# EAGLE design preamp (EAGLE 9.0.1)

## Sheet 1 of 2
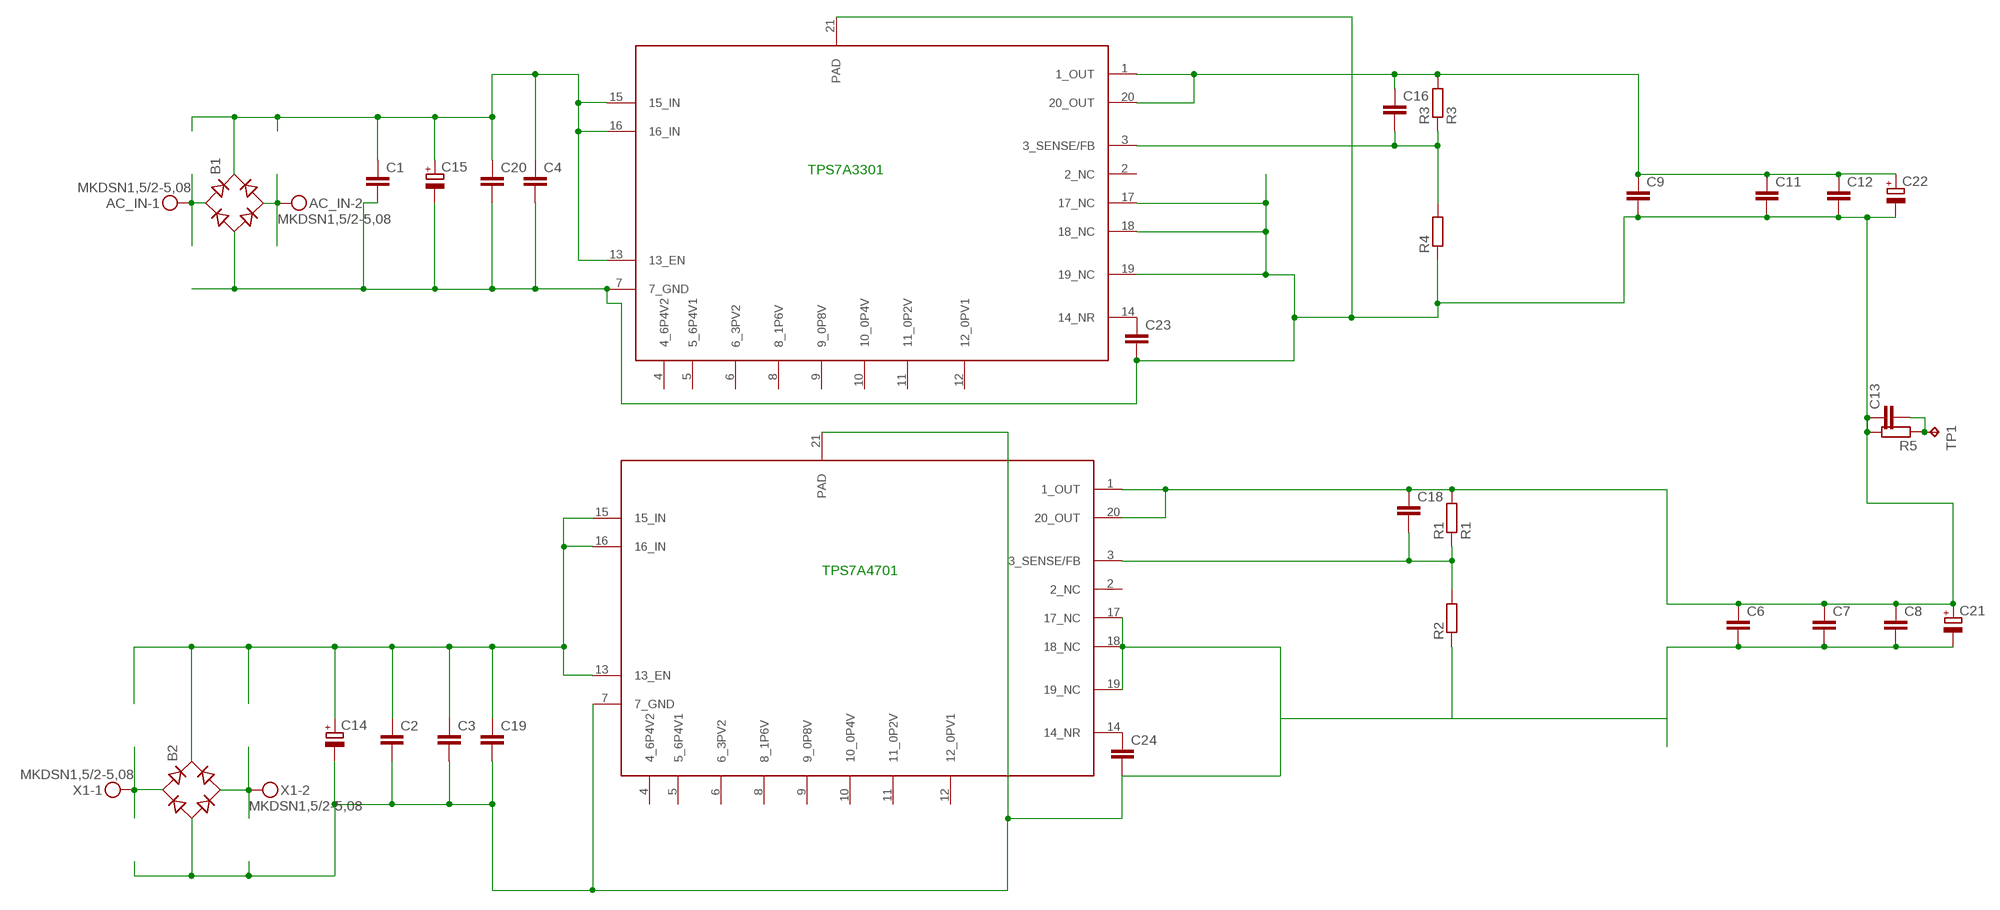
[diagram p0: schematic, sheet 1]

### Parts
AC_IN  MKDSN1,5/2-5,08  [MKDSN1,5/2-5,08]
B1  RB1A  [RB1A]
B2  RB1A  [RB1A]
C1  C-EUC1210  [C1210]
C2  C-EUC1210  [C1210]
C3  C-EUC0805  [C0805]
C4  C-EUC0805  [C0805]
C6  C-EUC0603  [C0603]
C7  C-EUC0805  [C0805]
C8  C-EUC1210  [C1210]
C9  C-EUC0603  [C0603]
C11  C-EUC1210  [C1210]
C12  C-EUC0805  [C0805]
C13  C-EU075-042X103  [C075-042X103]
C14  CPOL-EUE5-13  [E5-13]
C15  CPOL-EUE5-13  [E5-13]
C16  C-EUC0603  [C0603]
C18  C-EUC0603  [C0603]
C19  C-EUC0603  [C0603]
C20  C-EUC0603  [C0603]
C21  CPOL-EUE3.5-8  [E3,5-8]
C22  CPOL-EUE3.5-8  [E3,5-8]
C23  C-EUC0603  [C0603]
C24  C-EUC0603  [C0603]
R1  R1  R-EU_R0805  [R0805]
R2  R-EU_R0805  [R0805]
R3  R3  R-EU_R0805  [R0805]
R4  R-EU_R0805  [R0805]
R5  R-EU_0207/12  [0207/12]
TP1  TPPAD1-13  [P1-13]
U$1  TPS7A4701  [QFN65P500X500X100-21N]
U$2  TPS7A4701  [QFN65P500X500X100-21N]
X1  MKDSN1,5/2-5,08  [MKDSN1,5/2-5,08]

### Nets
GND: B1.- C1.2 C4.2 C6.1 C7.1 C8.1 C9.2 C11.2 C12.2 C13.1 C15.- C18.1 C20.2 C21.+ C22.- C23.2 R1.2 R4.1 R5.2 U$1.1(1_OUT) U$1.20(20_OUT) U$2.7(7_GND) U$2.17(17_NC) U$2.18(18_NC) U$2.19(19_NC) U$2.21(PAD) ; also sheet 2
N$2: AC_IN.1 B1.AC1
N$3: B2.+ C2.1 C3.1 C14.+ C19.1 U$1.13(13_EN) U$1.15(15_IN) U$1.16(16_IN)
N$5: C23.1 U$2.14(14_NR)
N$6: C16.2 R3.1 R4.2 U$2.3(3_SENSE/FB)
N$7: C24.1 U$1.14(14_NR)
N$9: B2.AC2 X1.2
N$10: B2.AC1 X1.1
N$12: AC_IN.2 B1.AC2
N$13: C13.2 R5.1 TP1.TP
N$15: B1.+ C1.1 C4.1 C15.+ C20.1 U$2.13(13_EN) U$2.15(15_IN) U$2.16(16_IN)
N$16: C18.2 R1.1 R2.2 U$1.3(3_SENSE/FB)
V+: C9.1 C11.1 C12.1 C16.1 C22.+ R3.2 U$2.1(1_OUT) U$2.20(20_OUT) ; also sheet 2
V-: B2.- C2.2 C3.2 C6.2 C7.2 C8.2 C14.- C19.2 C21.- C24.2 R2.1 U$1.7(7_GND) U$1.17(17_NC) U$1.18(18_NC) U$1.19(19_NC) U$1.21(PAD) ; also sheet 2
Unconnected: U$1.2(2_NC) U$1.4(4_6P4V2) U$1.5(5_6P4V1) U$1.6(6_3PV2) U$1.8(8_1P6V) U$1.9(9_0P8V) U$1.10(10_0P4V) U$1.11(11_0P2V) U$1.12(12_0PV1) U$2.2(2_NC) U$2.4(4_6P4V2) U$2.5(5_6P4V1) U$2.6(6_3PV2) U$2.8(8_1P6V) U$2.9(9_0P8V) U$2.10(10_0P4V) U$2.11(11_0P2V) U$2.12(12_0PV1)

### Notes on the sheet
- TPS7A3301
- TPS7A4701

## Sheet 2 of 2
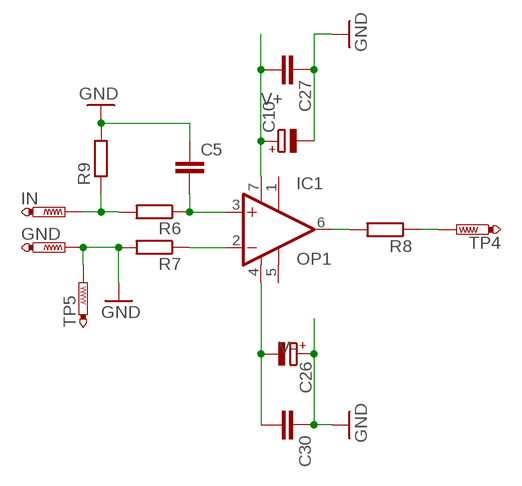
[diagram p1: schematic, sheet 2]

### Parts
C5  C-EU050-045X075  [C050-045X075]
C10  CPOL-EUE5-8.5  [E5-8,5]
C26  CPOL-EUE5-8.5  [E5-8,5]
C27  C-EU050-030X075  [C050-030X075]
C30  C-EU050-030X075  [C050-030X075]
GND  PTR1PAD1-20  [P1-20]
IC1  OP1  OPA627P  [DIL08]
IN  PTR1PAD1-20  [P1-20]
R6  R-EU_0207/10  [0207/10]
R7  R-EU_0207/10  [0207/10]
R8  R-EU_0207/10  [0207/10]
R9  R-EU_0207/10  [0207/10]
TP4  PTR1PAD1-20  [P1-20]
TP5  PTR1PAD1-20  [P1-20]

### Nets
GND: C5.1 C10.- C26.+ C27.1 C30.1 GND.TP R7.2 R9.2 TP5.TP ; also sheet 1
N$17: C5.2 IC1.3(+IN) R6.1
N$19: IC1.2(-IN) R7.1
N$20: IN.TP R6.2 R9.1
N$21: IC1.6(OUT) R8.2
N$23: R8.1 TP4.TP
V+: C10.+ C27.2 IC1.7(V+) ; also sheet 1
V-: C26.- C30.2 IC1.4(V-) ; also sheet 1
Unconnected: IC1.1(TRIM1) IC1.5(TRIM2)

## Library data of the parts
AC_IN X1 = con-phoenix-508:MKDSN1,5/2-5,08: MKDSN 1,5/ 2-5,08 Printklemme Nennstrom: 13,5 A Nennspannung: 250 V Rastermaß: 5,08 mm Polzahl: 2 Anschlussart: Schraubanschluss Montage: Löten Anschlussrichtung Leiter/Platine: 0 ° Artikelnummer: 1729128 Source: http://eshop.phoenixcontact.com .. 1729128.pdf
B1 B2 = rectifier:RB1A: RECTIFIER 1 A
C1-C9 C11-C13 C16 C18-C20 C23 C24 C27 C30 = Vwvwbg:C-EU: CAPACITOR, European symbol
C10 C14 C15 C21 C22 C26 = Vwvwbg:CPOL-EU: POLARIZED CAPACITOR, European symbol
GND IN TP4 TP5 = testpad:PTR1: TEST PIN
IC1 = burr-brown:OPA627: Difet(R) Operational Amplifiers Precision, High-Speed; MF: TEXAS INSTRUMENTS; MPN: OPA627BP; OC_FARNELL: 1212318; OC_NEWARK: 35C1918
R1-R9 = Vwvwbg:R-EU_: RESISTOR, European symbol
TP1 = testpad:TP: Test pad
U$1 U$2 = Texas Instruments_By_element14_Batch_1:TPS7A4701

## Board
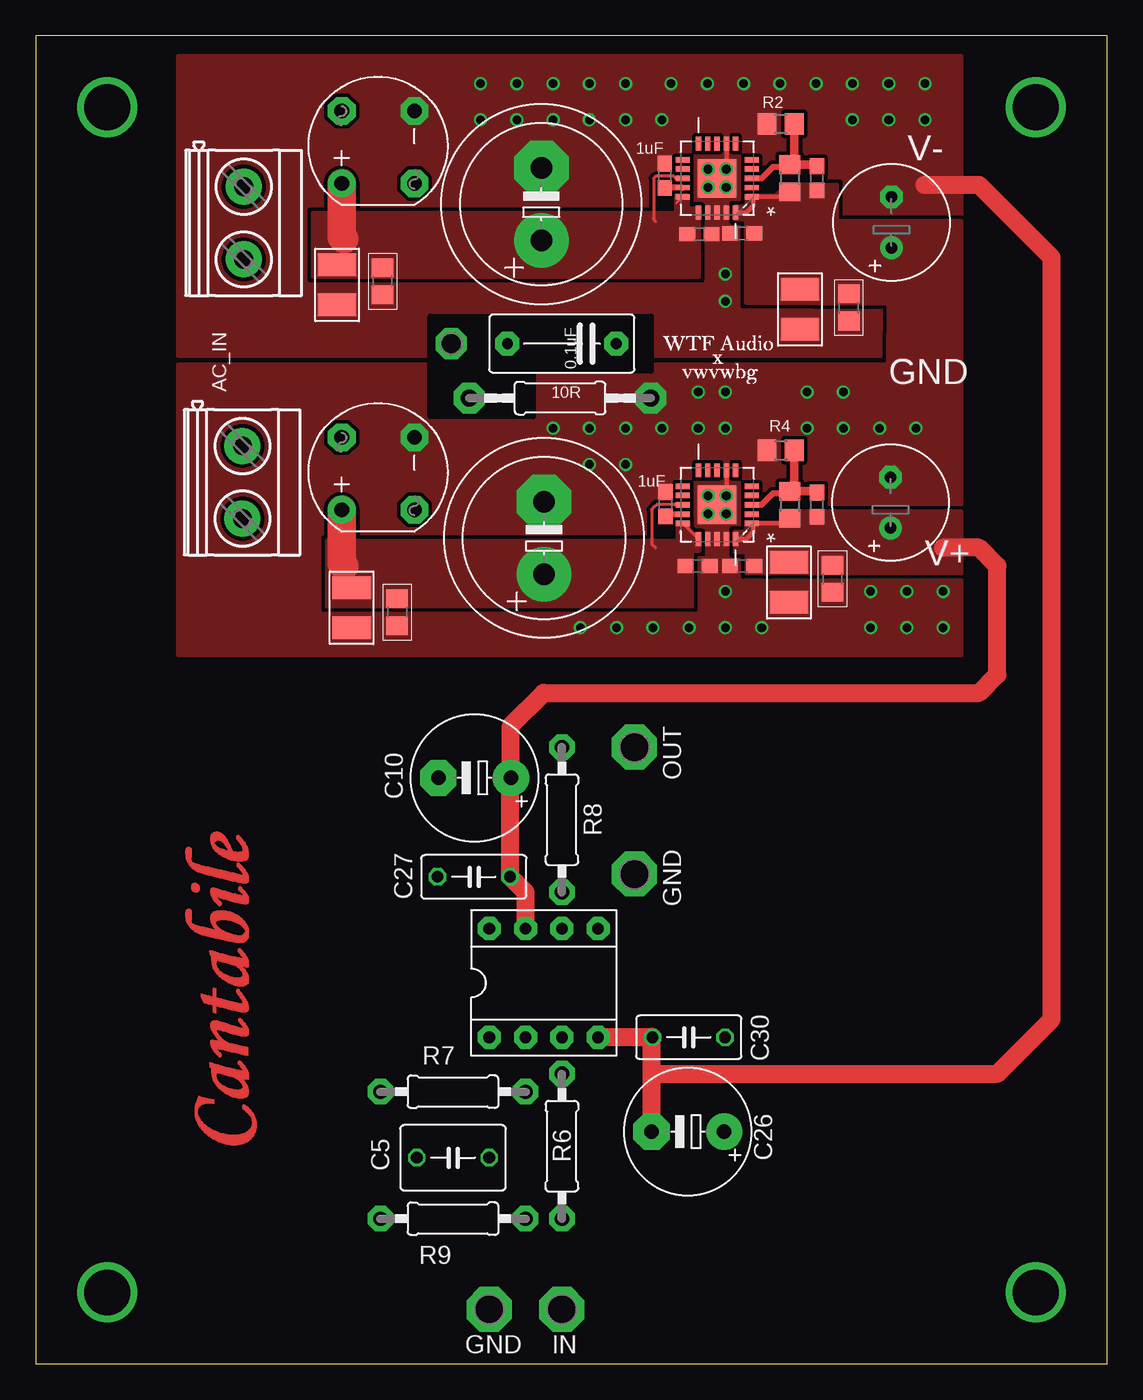
[diagram p2: board, top side]
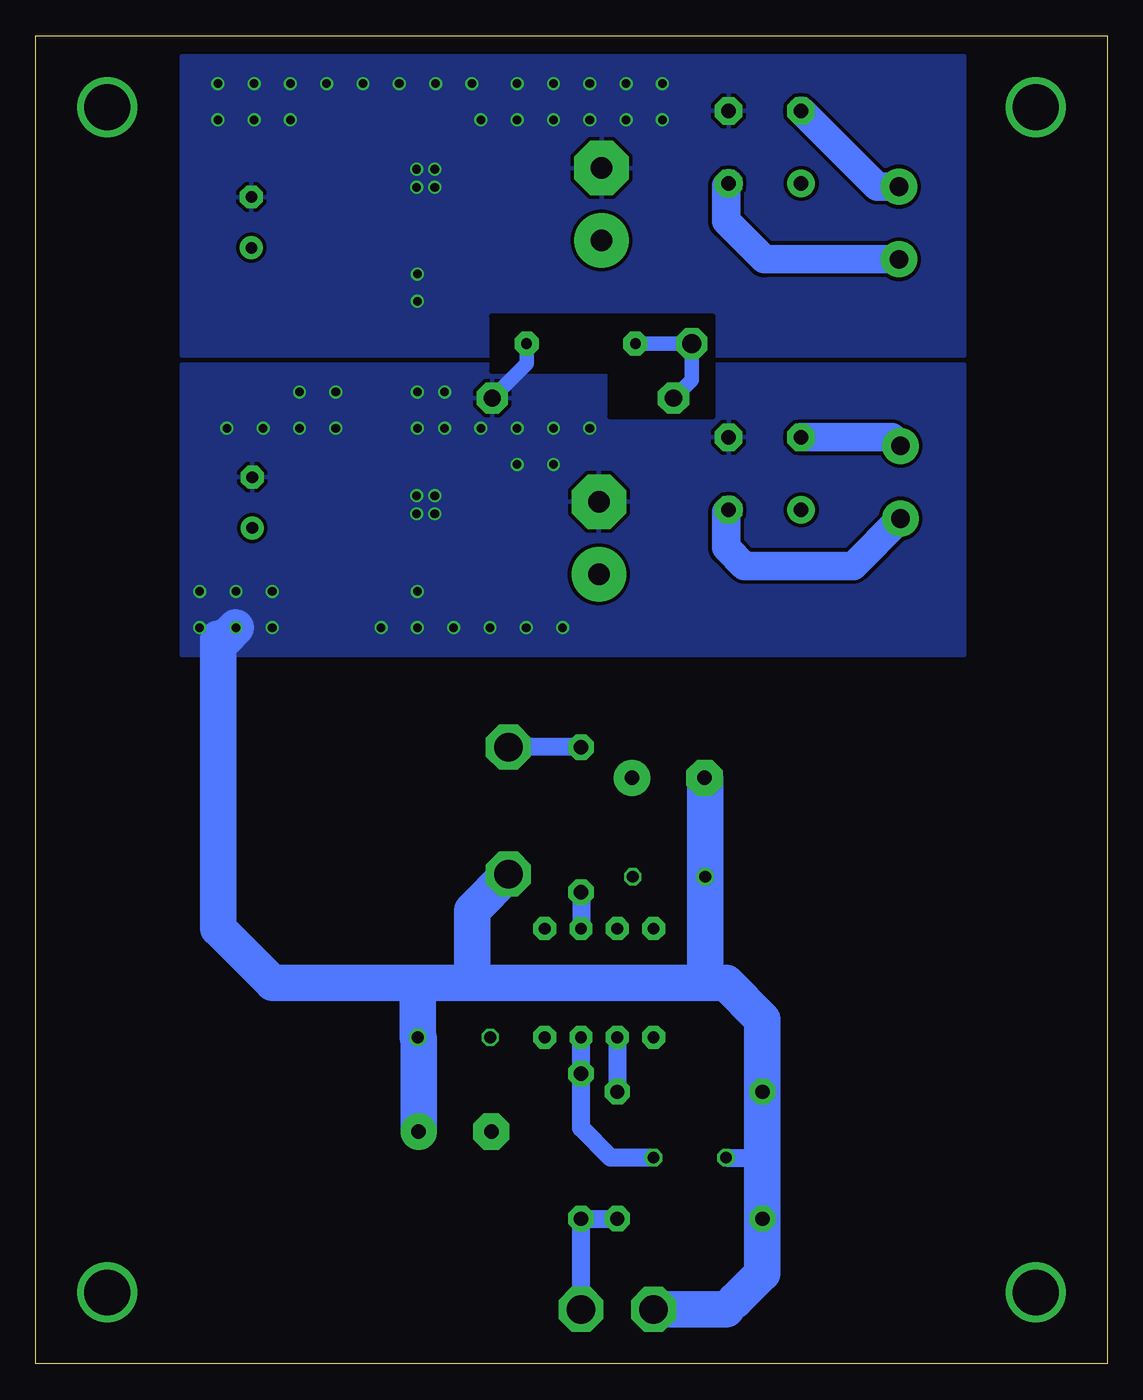
[diagram p3: board, bottom side, seen from below]

Size 75 x 93 mm. Coordinates in mm from the lower left corner, seen from the top.
Outline: 75,93 0,93 0,0 75,0 75,93
Copper layers (1*16): Top 0.035mm / dielectric 1.5mm / Bottom 0.035mm
Design rules "default *": minimum track width 6mil, minimum drill 0.3mm, track to track 7mil, track to pad 7mil, pad to pad 7mil, via to via 7mil, smd to smd 7mil, copper to edge 8mil, drill to drill 8mil, minimum pad ring 6mil, minimum via ring 6mil, stop-mask expansion 4mil, vias tented up to drill 25mil, thermal gap 10mil

### Footprints (pad centres in the part's own frame; a part is rotated, then mirrored left to right if it is on the bottom)
MKDSN1,5/2-5,08 = drill 1.3 pad 2.54: 1 -2.561,0.025; 2 2.519,0.025
RB1A = drill 1.016 pad 1.93: + -2.54,2.54 | drill 1.016 pad 1.93 octagon: - 2.54,-2.54; AC1 2.54,2.54; AC2 -2.54,-2.54
C1210 = smd 1.6 x 2.7: 1 -1.4,0; 2 1.4,0
C0805 = smd 1.3 x 1.5: 1 -0.95,0; 2 0.95,0
C050-045X075 = drill 0.813 octagon: 1 -2.54,0; 2 2.54,0
C0603 = smd 1.1 x 1: 1 -0.85,0; 2 0.85,0
E5-8,5 = drill 1.016 pad 2.54: + -2.54,0 | drill 1.016 pad 2.54 octagon: - 2.54,0
C075-042X103 = drill 0.75 pad 1.676 octagon: 1 -3.81,0; 2 3.81,0
E5-13 = drill 1.5 pad 3.81: + -2.54,0 | drill 1.5 pad 3.81 octagon: - 2.54,0
E3,5-8 = drill 0.813 pad 1.6: + -1.778,0 | drill 0.813 pad 1.6 octagon: - 1.778,0
C050-030X075 = drill 0.813 octagon: 1 -2.54,0; 2 2.54,0
P1-20 = drill 2.007 pad 3.15 octagon: TP 0,0
DIL08 = drill 0.813 pad 1.6 octagon: 1 -3.81,-3.81; 2 -1.27,-3.81; 3 1.27,-3.81; 4 3.81,-3.81; 5 3.81,3.81; 6 1.27,3.81; 7 -1.27,3.81; 8 -3.81,3.81
R0805 = smd 1.3 x 1.5: 1 -0.95,0; 2 0.95,0
0207/12 = drill 1.2 pad 2.184 octagon: 1 -6.35,0; 2 6.35,0
0207/10 = drill 1 pad 1.778 octagon: 1 -5.08,0; 2 5.08,0
P1-13 = drill 1.321 pad 2.159 octagon: TP 0,0
QFN65P500X500X100-21N = smd 0.965 x 0.381: 1 -2.413,1.295; 2 -2.413,0.66; 3 -2.413,0; 4 -2.413,-0.66; 5 -2.413,-1.295; 11 2.413,-1.295; 12 2.413,-0.66; 13 2.413,0; 14 2.413,0.66; 15 2.413,1.295 | smd 0.381 x 0.965: 6 -1.295,-2.413; 7 -0.66,-2.413; 8 0,-2.413; 9 0.66,-2.413; 10 1.295,-2.413; 16 1.295,2.413; 17 0.66,2.413; 18 0,2.413; 19 -0.66,2.413; 20 -1.295,2.413 | smd 2.692 x 2.692: 21 0,0

### Placement (x,y rotation side)
AC_IN  14.44,61.71 270 top
B1  23.96,62.34 90 top
B2  23.96,85.2 90 top
C1  22.12,52.94 270 top
C2  21.1,75.55 270 top
C3  24.28,75.8 270 top
C4  25.3,52.62 270 top
C5  29.21,14.43 0 top
C6  49.45,79.16 180 top
C7  56.92,73.96 270 top
C8  53.49,73.83 270 top
C9  49.45,55.86 180 top
C10  30.72,41.03 180 top
C11  52.73,54.72 270 top
C12  55.78,54.97 270 top
C13  36.83,71.44 180 top
C14  35.39,81.2 90 top
C15  35.58,57.83 90 top
C16  54.69,60.16 90 top
C18  54.69,83.02 90 top
C19  46.46,79.1 0 top
C20  46.34,55.86 0 top
C21  59.9,79.93 90 top
C22  59.84,60.31 90 top
C23  44.09,60.2 90 top
C24  44.03,83.18 90 top
C26  45.65,16.26 180 top
C27  30.67,34.1 0 top
C30  45.72,22.86 180 top
GND  31.75,3.81 0 top
IC1  35.56,26.67 0 top
IN  36.83,3.81 0 top
R1  52.78,83.02 270 top
R2  52.15,86.83 0 top
R3  52.78,60.16 270 top
R4  52.15,63.97 0 top
R5  36.7,67.63 0 top
R6  36.83,15.24 270 top
R7  29.21,19.05 180 top
R8  36.83,38.1 270 top
R9  29.21,10.16 180 top
TP1  29.08,71.44 270 top
TP4  41.91,43.18 0 top
TP5  41.91,34.29 0 top
U$1  47.7,83.02 180 top
U$2  47.7,60.16 180 top
X1  14.54,79.87 270 top

### Tracks (layer width: path | path; a pad name or v marks a point on that pad's centre or on a via)
GND  (via drill 0.6)
  Top 0.305: R1.2 52.58,81.72 U$1.1 50.24,81.59 50.24,81.11 49.74,80.6 U$1.20 | U$2.7 48.37,60.82 v48.34,60.79
  Bottom 1.016: C13.1 40.64,70.04 R5.2 | 48.19,22.79 C30.1
  Bottom 1.27: 26.67,3.81 26.04,4.45 | 28.18,34.15 C27.1 | R9.2 24.13,13.97 | 24.13,13.97 R7.2 | C5.1 24.59,14.43 24.13,13.97
  Bottom 2.54: 27.94,26.67 26.67,26.67 24.13,24.13 R7.2 R9.2 24.13,6.35 26.04,4.45 | 27.94,26.67 44.45,26.67 | 44.45,26.67 48.26,26.67 | 48.26,26.67 58.42,26.67 62.23,30.48 62.23,50.8 61.73,50.8 v60.98,51.55 | C26.+ 48.19,22.79 | 48.26,26.67 C30.1 | 27.94,26.67 28.13,26.86 C27.1 28.13,40.98 C10.- | GND.TP 26.67,3.81 | 44.45,26.67 44.45,31.75 TP5.TP | 27.94,26.67
  other vias: 47.07,60.79 47.07,59.52 45.74,51.55 48.28,51.55 48.28,54.09 46.38,65.52 54,65.52 54,68.06 56.54,68.06 56.54,65.52 48.34,59.52 48.28,65.52 48.28,68.06 46.38,68.06 43.84,65.52 41.3,65.52 38.76,65.52 36.22,65.52 38.76,62.98 41.3,62.98 43.2,51.55 40.66,51.55 38.12,51.55 50.82,51.55 58.44,51.55 58.44,54.09 60.98,54.09 63.52,51.55 63.52,54.09 59.08,65.52 61.62,65.52
  pour Bottom (isolate 0.254, rank 2): 9.99,69.96 9.99,49.64 64.79,49.64 64.79,69.96
  pour Top (isolate 0.254, rank 2, no thermals): 9.99,69.96 9.99,49.64 64.79,49.64 64.79,69.96
  pour Top (no thermals): 48.96,81.03 48.96,80.14 49.72,80.14 49.72,74.3 59.67,74.25 59.72,74.3 59.67,69.93 64.79,69.93 64.79,80.01 56.07,80.01 56.07,82.55 52.64,82.61 51.82,81.79 49.78,81.79 49.78,81.03
N$1  (via drill 3.2)
  other vias: 70,5
N$2
  Bottom 2: B1.AC1 15.08,64.88 AC_IN.1
N$3
  Top 0.203: U$1.13 44.79,83.02 44.65,83.16 43.42,83.16 43.25,83 43.25,80.26 arc45 43.35,80.03 43.37,80.01 | 44.85,81.28 U$1.15
  Top 2: 36.22,78.84 C14.+ | B2.+ 21.42,78.91 21.59,78.74
  pour Top (no thermals): 44.83,81.79 45.66,81.79 45.66,80.9 46.42,80.9 46.42,76.14 19.43,76.14 19.43,80.58 44.84,80.57
N$4  (via drill 3.2)
  other vias: 5,5
N$5
  Top 0.406: U$2.14 44.24,59.5 C23.1
N$6
  Top 0.406: U$2.3 50.82,60.16 51.62,60.96 52.64,60.96 R3.1
  Top 0.61: R4.2 53.1,61.42 R3.1 54.59,61.11 C16.2
N$7
  Top 0.406: U$1.14 44.06,82.36 C24.1
N$8  (via drill 3.2)
  other vias: 5,88
N$9
  Bottom 2: X1.2 24.01,77.35 26.67,80.01 26.67,82.49 B2.AC2
N$10
  Bottom 2: X1.1 16.11,82.43 B2.AC1
N$11  (via drill 3.2)
  other vias: 70,88
N$12
  Bottom 2: AC_IN.2 14.47,59.19 17.78,55.88 25.4,55.88 26.67,57.15 26.67,59.63 B1.AC2
N$13
  Bottom 1.016: C13.2 TP1.TP 29.08,68.9 R5.1
N$14
  cutout Top: 43.05,73.34 43.05,69.53 34.8,69.53 34.8,66.36 27.62,66.36 27.62,73.34
N$15
  Top 0.203: U$2.13 44.73,60.16 44.71,60.18 43.48,60.18 43.31,60.02 43.31,60.01 43.12,59.82 43.12,57.54 arc45 43.21,57.31 43.37,57.15 | 45.08,58.23 45.15,58.17
  Top 0.254: U$2.15 U$2.16
  Top 2: B1.+ 21.42,56.05 21.59,55.88
  pour Top (no thermals): 45.72,58.93 44.89,58.93 44.89,57.66 20.38,57.66 20.38,53.02 45.97,53.02 45.97,56.9 46.47,56.9 46.47,58.1 45.72,58.1
N$16
  Top 0.406: U$1.3 50.82,83.02 51.62,83.82 52.64,83.82 R1.1
  Top 0.61: R2.2 53.1,84.28 R1.1 54.59,83.97 C18.2
N$17
  Bottom 1.27: C5.2 34.75,14.43 36.83,16.51 R6.1 IC1.3
N$18
  cutout Bottom: 43.05,73.34 43.05,69.53 34.8,69.53 34.8,66.36 27.62,66.36 27.62,73.34
N$19
  Bottom 1.27: IC1.2 R7.1
N$20
  Bottom 1.27: IN.TP R6.2 R9.1
N$21
  Bottom 1.27: R8.2 IC1.6
N$23
  Bottom 1.27: R8.1 TP4.TP
V+
  Top 0.305: U$2.20 49.74,57.74 50.24,58.25 50.24,58.73 U$2.1 52.58,58.86 R3.2
  Top 1.27: IC1.7 34.29,33.02 C27.2 33.21,40.98 C10.+ 33.26,44.69 35.56,46.99 66.04,46.99 67.31,48.26 67.31,55.88 66.04,57.15 63.5,57.15
  pour Top (no thermals): 48.96,58.23 48.96,56.83 49.78,56.83 49.78,55.37 64.79,55.37 64.79,59.69 53.59,59.69 52.77,58.86 49.78,58.86 49.78,58.23
V-  (via drill 0.6)
  Top 0.305: U$1.7 48.37,83.68 v48.34,83.65
  Top 1.27: IC1.4 C30.2 43.11,22.79 43.11,20.32 | C26.- 43.11,20.32 | 62.23,82.55 66.04,82.55 71.12,77.47 71.12,24.13 67.31,20.32 43.11,20.32
  other vias: 47.07,83.65 47.07,82.38 47.01,89.65 36.22,89.65 41.3,89.65 38.76,89.65 33.68,89.65 48.28,74.41 49.55,89.65 48.28,76.31 52.09,89.65 48.34,82.38 54.63,89.65 57.17,89.65 57.17,87.11 59.71,87.11 59.71,89.65 62.25,89.65 62.25,87.11 44.47,89.65 31.14,89.65 31.14,87.11 33.68,87.11 36.22,87.11 38.76,87.11 41.3,87.11 43.84,87.11
  pour Bottom (isolate 0.254, rank 3): 64.79,91.55 64.79,70.6 9.99,70.6 9.99,91.55
  pour Top (isolate 0.254, rank 3, no thermals): 64.79,91.55 64.79,70.6 9.99,70.6 9.99,91.55
(copper drawn outside any net)
  shapes: Top area x1570

### Text on the board
tPlace: 1uF | V- | AC_IN | 0.1uF | GND | 10R | 1uF | V+ | OUT | GND | GND